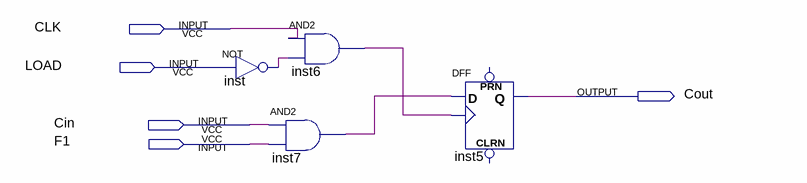
[diagram p0: schematic sheet]
// Quartus schematic Controller.bdf as structural Verilog: 4 symbols, 5 pins
module Controller (
  input  CLK,
  input  LOAD,
  input  Cin,
  input  F1,
  output Cout
);

  wire inst6_out, inst7_out, inst_out;

  not inst (inst_out, LOAD);
  and inst6 (inst6_out, CLK, inst_out);
  and inst7 (inst7_out, Cin, F1);
  DFF inst5 (.CLK(inst6_out), .D(inst7_out), .Q(Cout));  // open: CLRN, PRN
endmodule
